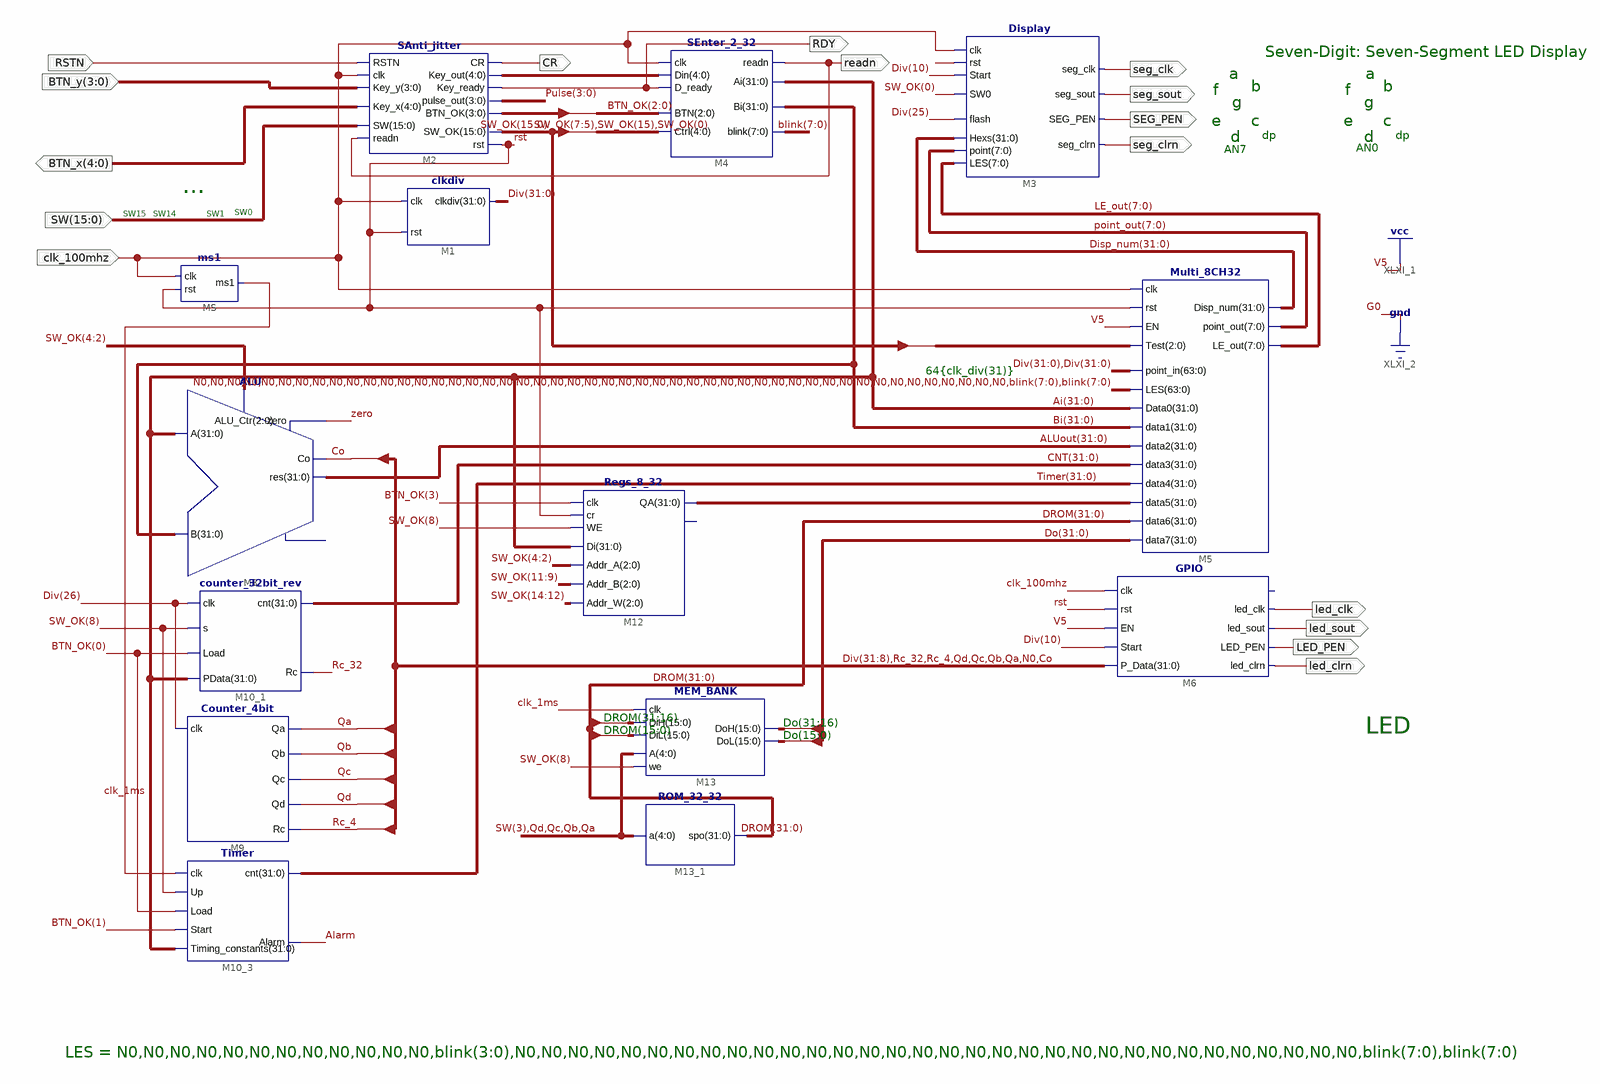
[diagram p0: schematic sheet 1]
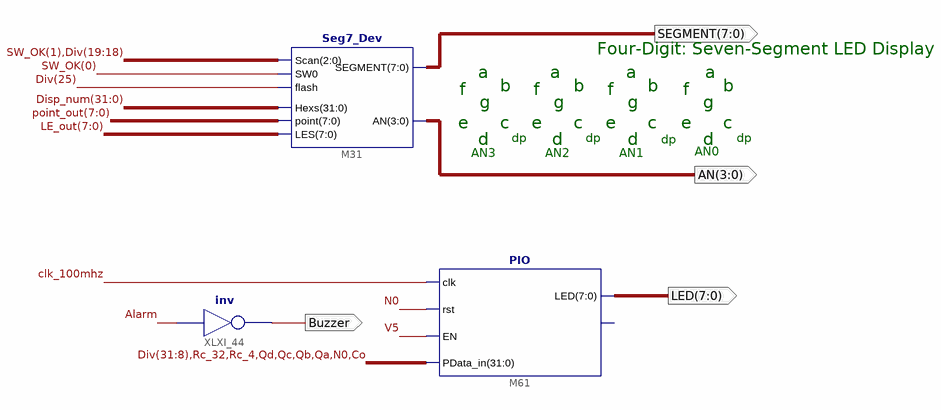
[diagram p1: schematic sheet 2]
// Xilinx ISE schematic Top_MEMS.sch (kintex7) as structural Verilog: 17 symbols, 20 ports
module Top_MEMS (
  input  clk_100mhz,
  input  [15:0] SW,
  input  [3:0] BTN_y,
  input  RSTN,
  output seg_clk,
  output seg_sout,
  output SEG_PEN,
  output seg_clrn,
  output readn,
  output RDY,
  output [4:0] BTN_x,
  output CR,
  output [7:0] SEGMENT,
  output [3:0] AN,
  output Buzzer,
  output [7:0] LED,
  output led_clrn,
  output LED_PEN,
  output led_clk,
  output led_sout
);

  wire Alarm, clk_1ms, Co, N0, Qa, Qb, Qc, Qd, Rc_4, Rc_32, rst, zero;
  wire [3:0] BTN_OK, Pulse;
  wire [4:0] XLXN_444;
  wire [7:0] blink, LE_out, point_out;
  wire [15:0] SW_OK;
  wire [31:0] Ai, ALUout, Bi, CNT, Disp_num, Div, Do, DROM, Timer, XLXN_449;

  SAnti_jitter M2 (
    .SW(SW), .readn(readn), .Key_y(BTN_y), .Key_x(BTN_x), .RSTN(RSTN), .clk(clk_100mhz), .Key_out(XLXN_444),
    .Key_ready(RDY), .CR(CR), .rst(rst), .SW_OK(SW_OK), .pulse_out(Pulse), .BTN_OK(BTN_OK));
  SEnter_2_32 M4 (
    .readn(readn), .Ai(Ai), .Bi(Bi), .blink(blink), .Din(XLXN_444), .D_ready(RDY), .clk(clk_100mhz),
    .Ctrl({SW_OK[7:5], SW_OK[15], SW_OK[0]}), .BTN(BTN_OK[2:0]));
  clkdiv M1 (.rst(rst), .clkdiv(Div), .clk(clk_100mhz));
  Display M3 (
    .LES(LE_out), .SEG_PEN(SEG_PEN), .seg_sout(seg_sout), .seg_clrn(seg_clrn), .point(point_out),
    .Hexs(Disp_num), .SW0(SW_OK[0]), .flash(Div[25]), .seg_clk(seg_clk), .clk(clk_100mhz), .rst(rst),
    .Start(Div[10]));
  Seg7_Dev M31 (
    .LES(LE_out), .Scan({SW_OK[1], Div[19:18]}), .SEGMENT(SEGMENT), .AN(AN), .point(point_out),
    .flash(Div[25]), .SW0(SW_OK[0]), .Hexs(Disp_num));
  Multi_8CH32 M5 (
    .Test(SW_OK[7:5]), .point_in({Div, Div}), .EN(1'b1), .clk(clk_100mhz), .rst(rst),
    .LES({{48{N0}}, blink, blink}), .Data0(Ai), .data1(Bi), .data2(ALUout), .data3(CNT), .data4(Timer),
    .data5(XLXN_449), .data6(DROM), .data7(Do), .point_out(point_out), .LE_out(LE_out), .Disp_num(Disp_num));
  PIO M61 (
    .clk(clk_100mhz), .rst(N0), .EN(1'b1), .PData_in({Div[31:8], Rc_32, Rc_4, Qd, Qc, Qb, Qa, N0, Co}),
    .LED(LED));  // open: GPIOf0
  ALU M8 (.A(Ai), .B(Bi), .res(ALUout), .zero(zero), .Co(Co), .ALU_Ctr(SW_OK[4:2]));  // open: overflow
  counter_32bit_rev M10_1 (.clk(Div[26]), .s(SW_OK[8]), .Load(BTN_OK[0]), .Rc(Rc_32), .cnt(CNT), .PData(Ai));
  Counter_4bit M9 (.clk(Div[26]), .Qa(Qa), .Qb(Qb), .Qc(Qc), .Qd(Qd), .Rc(Rc_4));
  Timer M10_3 (
    .clk(clk_1ms), .Alarm(Alarm), .cnt(Timer), .Timing_constants(Ai), .Up(SW_OK[8]), .Load(BTN_OK[0]),
    .Start(BTN_OK[1]));
  not XLXI_44 (Buzzer, Alarm);
  ms1 MS (.clk(clk_100mhz), .rst(rst), .ms1(clk_1ms));
  Regs_8_32 M12 (
    .QA(XLXN_449), .clk(BTN_OK[3]), .cr(rst), .WE(SW_OK[8]), .Di(Ai), .Addr_W(SW_OK[14:12]),
    .Addr_B(SW_OK[11:9]), .Addr_A(SW_OK[4:2]));  // open: QB
  GPIO M6 (
    .clk(clk_100mhz), .P_Data({Div[31:8], Rc_32, Rc_4, Qd, Qc, Qb, Qa, N0, Co}), .rst(rst), .EN(1'b1),
    .Start(Div[10]), .led_clrn(led_clrn), .led_clk(led_clk), .led_sout(led_sout), .LED_PEN(LED_PEN));  // open: GPIOf0
  ROM_32_32 M13_1 (.a({SW[3], Qd, Qc, Qb, Qa}), .spo(DROM));
  MEM_BANK M13 (
    .DiH(DROM[31:16]), .we(SW_OK[8]), .clk(clk_1ms), .A({SW[3], Qd, Qc, Qb, Qa}), .DiL(DROM[15:0]),
    .DoH(Do[31:16]), .DoL(Do[15:0]));

  // Notes on the sheet:
  //   Seven-Digit: Seven-Segment LED Display
  //   a
  //   a
  //   b
  //   b
  //   f
  //   f
  //   g
  //   g
  //   e
  //   c
  //   e
  //   c
  //   dp
  //   dp
  //   d
  //   d
  //   AN0
  //   AN7
  //   ...
  //   SW0
  //   SW15
  //   SW14
  //   SW1
  //   64{clk_div(31)}
  //   DROM(31:16)
  //   Do(31:16)
  //   LED
  //   DROM(15:0)
  //   Do(15:0)
  //   LES = N0,N0,N0,N0,N0,N0,N0,N0,N0,N0,N0,N0,blink(3:0),N0,N0,N0,N0,N0,N0,N0,N0,N0,N0,N0,N0,N0,N0,N0,N0,N0,N0,N0,N0,N0,N0,N0,N0,N0,N0,N0,N0,N0,N0,N0,N0,blink(7:0),blink(7:0)
  //   Four-Digit: Seven-Segment LED Display
  //   a
  //   a
  //   a
  //   a
  //   b
  //   b
  //   b
  //   b
  //   f
  //   f
  //   f
  //   f
  //   g
  //   g
  //   g
  //   g
  //   e
  //   c
  //   e
  //   c
  //   e
  //   c
  //   e
  //   c
  //   dp
  //   dp
  //   dp
  //   d
  //   d
  //   d
  //   dp
  //   d
  //   AN0
  //   AN3
  //   AN2
  //   AN1
  //   LOC on signal clk_100mhz = t9
endmodule
